# Altium schematic sheet BOC_Top.SchDoc: Board-On-Chip Block Diagram
size A; Organization: Altium Limited; Address1: L3, 12a Rodborough Rd; Address2: Frenchs Forest; Address3: NSW; Address4: Australia 2086; Revision: 1.06; SheetNumber: 1; SheetTotal: 16
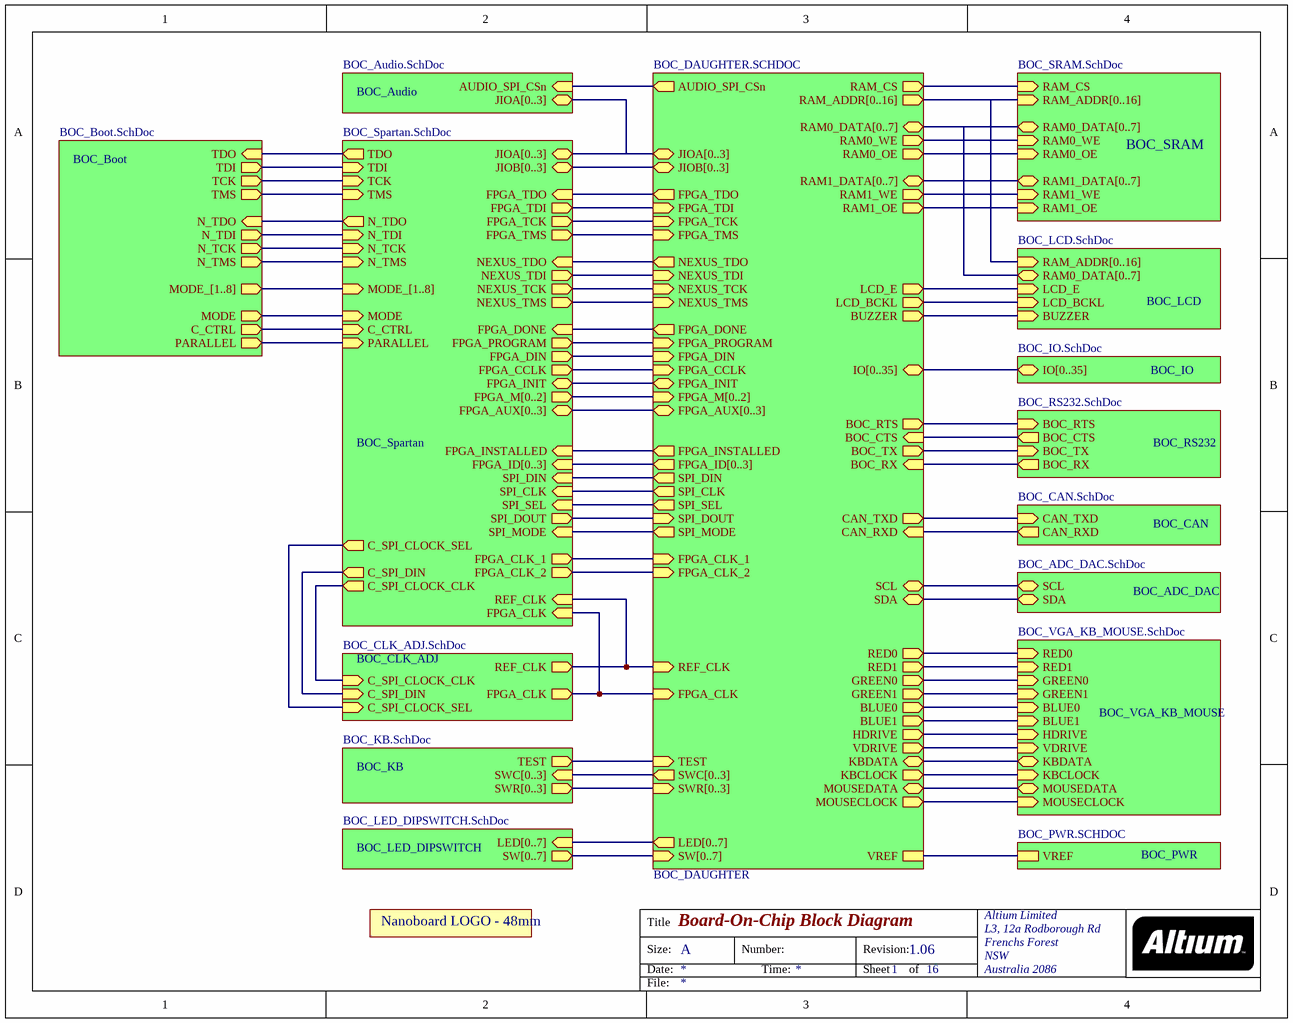
[diagram p0: BOC_Top.SchDoc]

## Parts
LOGO1  NanoboardLogo48mm  [NanoboardLogo48mm]  (value not drawn)  (graphical)

## Sub-sheets
BOC_ADC_DAC = BOC_ADC_DAC.SchDoc: SCL (bidir), SDA (bidir)
BOC_Audio = BOC_Audio.SchDoc: AUDIO_SPI_CSn (in), JIOA[0..3] (bidir)
BOC_Boot = BOC_Boot.SchDoc: TCK (out), TDO (in), TDI (out), TMS (out), C_CTRL (out), PARALLEL (out), MODE_[1..8] (out), N_TDI (out), N_TDO (in), N_TCK (out), N_TMS (out), MODE (out)
BOC_CAN = BOC_CAN.SchDoc: CAN_TXD (in), CAN_RXD (out)
BOC_CLK_ADJ = BOC_CLK_ADJ.SchDoc: FPGA_CLK (out), REF_CLK (out), C_SPI_CLOCK_SEL (in), C_SPI_DIN (in), C_SPI_CLOCK_CLK (in)
BOC_DAUGHTER = BOC_DAUGHTER.SCHDOC: FPGA_DONE (out), FPGA_PROGRAM (in), FPGA_CCLK (in), FPGA_DIN (in), IO[0..35] (bidir), BOC_RTS (out), BOC_TX (out), BOC_CTS (in), BOC_RX (in), CAN_TXD (out), CAN_RXD (in), JIOA[0..3] (bidir), JIOB[0..3] (bidir), LED[0..7] (out), SW[0..7] (in), LCD_BCKL (out), FPGA_AUX[0..3] (bidir), FPGA_M[0..2] (in), FPGA_TDI (in), FPGA_TCK (in), FPGA_TMS (in), FPGA_TDO (out), RAM_ADDR[0..16] (out), RAM0_DATA[0..7] (bidir), RAM1_DATA[0..7] (bidir), RAM0_OE (out), RAM0_WE (out), RAM1_OE (out), RAM1_WE (out), RAM_CS (out), RED0 (out), RED1 (out), GREEN0 (out), GREEN1 (out), BLUE0 (out), BLUE1 (out), HDRIVE (out), VDRIVE (out), KBDATA (bidir), KBCLOCK (out), MOUSEDATA (bidir), MOUSECLOCK (out), SWC[0..3] (out), SWR[0..3] (in), FPGA_CLK (in), TEST (in), SCL (bidir), SDA (bidir), NEXUS_TDI (in), NEXUS_TCK (in), NEXUS_TMS (in), NEXUS_TDO (out), BUZZER (out), FPGA_INIT (bidir), VREF, SPI_MODE (out), SPI_DOUT (in), SPI_SEL (out), SPI_CLK (out), SPI_DIN (out), FPGA_CLK_1 (in), FPGA_CLK_2 (in), FPGA_INSTALLED (out), REF_CLK (in), FPGA_ID[0..3] (out), LCD_E (out), AUDIO_SPI_CSn (out)
BOC_IO = BOC_IO.SchDoc: IO[0..35] (bidir)
BOC_KB = BOC_KB.SchDoc: SWC[0..3] (in), SWR[0..3] (out), TEST (out)
BOC_LCD = BOC_LCD.SchDoc: RAM0_DATA[0..7] (bidir), LCD_BCKL (in), RAM_ADDR[0..16] (in), BUZZER (in), LCD_E (in)
BOC_LED_DIPSWITCH = BOC_LED_DIPSWITCH.SchDoc: LED[0..7] (in), SW[0..7] (out)
BOC_PWR = BOC_PWR.SCHDOC: VREF
BOC_RS232 = BOC_RS232.SchDoc: BOC_RTS (in), BOC_TX (in), BOC_CTS (out), BOC_RX (out)
BOC_Spartan = BOC_Spartan.SchDoc: FPGA_TDI (out), FPGA_TCK (out), FPGA_TMS (out), FPGA_TDO (in), FPGA_DONE (in), FPGA_PROGRAM (out), FPGA_CCLK (out), FPGA_DIN (out), FPGA_AUX[0..3] (bidir), FPGA_M[0..2] (out), JIOA[0..3] (bidir), JIOB[0..3] (bidir), REF_CLK (in), FPGA_INIT (bidir), NEXUS_TDO (in), NEXUS_TDI (out), NEXUS_TCK (out), NEXUS_TMS (out), FPGA_CLK_1 (out), FPGA_CLK_2 (out), FPGA_INSTALLED (in), SPI_DIN (in), SPI_CLK (in), SPI_SEL (in), SPI_DOUT (out), SPI_MODE (in), C_SPI_CLOCK_CLK (out), C_SPI_DIN (out), C_SPI_CLOCK_SEL (out), FPGA_ID[0..3] (in), TCK (in), TDO (out), TDI (in), TMS (in), C_CTRL (in), PARALLEL (in), MODE_[1..8] (in), N_TDI (in), N_TDO (out), N_TCK (in), N_TMS (in), MODE (in), FPGA_CLK (in)
BOC_SRAM = BOC_SRAM.SchDoc: RAM_ADDR[0..16] (in), RAM1_DATA[0..7] (bidir), RAM0_WE (in), RAM0_OE (in), RAM1_WE (in), RAM1_OE (in), RAM_CS (in), RAM0_DATA[0..7] (bidir)
BOC_VGA_KB_MOUSE = BOC_VGA_KB_MOUSE.SchDoc: RED0 (in), RED1 (in), GREEN0 (in), GREEN1 (in), BLUE0 (in), BLUE1 (in), HDRIVE (in), VDRIVE (in), KBDATA (bidir), KBCLOCK (in), MOUSEDATA (bidir), MOUSECLOCK (in)

## Nets
(unnamed): sheet BOC_SRAM/RAM0_WE, sheet BOC_DAUGHTER/RAM0_WE
(unnamed): sheet BOC_SRAM/RAM0_OE, sheet BOC_DAUGHTER/RAM0_OE
(unnamed): sheet BOC_SRAM/RAM1_WE, sheet BOC_DAUGHTER/RAM1_WE
(unnamed): sheet BOC_SRAM/RAM1_OE, sheet BOC_DAUGHTER/RAM1_OE
(unnamed): sheet BOC_SRAM/RAM_CS, sheet BOC_DAUGHTER/RAM_CS
(unnamed): sheet BOC_KB/TEST, sheet BOC_DAUGHTER/TEST
(unnamed): sheet BOC_PWR/VREF, sheet BOC_DAUGHTER/VREF
(unnamed): sheet BOC_RS232/BOC_RTS, sheet BOC_DAUGHTER/BOC_RTS
(unnamed): sheet BOC_RS232/BOC_TX, sheet BOC_DAUGHTER/BOC_TX
(unnamed): sheet BOC_RS232/BOC_CTS, sheet BOC_DAUGHTER/BOC_CTS
(unnamed): sheet BOC_RS232/BOC_RX, sheet BOC_DAUGHTER/BOC_RX
(unnamed): sheet BOC_ADC_DAC/SCL, sheet BOC_DAUGHTER/SCL
(unnamed): sheet BOC_ADC_DAC/SDA, sheet BOC_DAUGHTER/SDA
(unnamed): sheet BOC_CAN/CAN_TXD, sheet BOC_DAUGHTER/CAN_TXD
(unnamed): sheet BOC_CAN/CAN_RXD, sheet BOC_DAUGHTER/CAN_RXD
(unnamed): sheet BOC_CLK_ADJ/FPGA_CLK, sheet BOC_Spartan/FPGA_CLK, sheet BOC_DAUGHTER/FPGA_CLK
(unnamed): sheet BOC_CLK_ADJ/REF_CLK, sheet BOC_Spartan/REF_CLK, sheet BOC_DAUGHTER/REF_CLK
(unnamed): sheet BOC_CLK_ADJ/C_SPI_CLOCK_SEL, sheet BOC_Spartan/C_SPI_CLOCK_SEL
(unnamed): sheet BOC_CLK_ADJ/C_SPI_DIN, sheet BOC_Spartan/C_SPI_DIN
(unnamed): sheet BOC_CLK_ADJ/C_SPI_CLOCK_CLK, sheet BOC_Spartan/C_SPI_CLOCK_CLK
(unnamed): sheet BOC_LCD/LCD_BCKL, sheet BOC_DAUGHTER/LCD_BCKL
(unnamed): sheet BOC_LCD/BUZZER, sheet BOC_DAUGHTER/BUZZER
(unnamed): sheet BOC_LCD/LCD_E, sheet BOC_DAUGHTER/LCD_E
(unnamed): sheet BOC_VGA_KB_MOUSE/RED0, sheet BOC_DAUGHTER/RED0
(unnamed): sheet BOC_VGA_KB_MOUSE/RED1, sheet BOC_DAUGHTER/RED1
(unnamed): sheet BOC_VGA_KB_MOUSE/GREEN0, sheet BOC_DAUGHTER/GREEN0
(unnamed): sheet BOC_VGA_KB_MOUSE/GREEN1, sheet BOC_DAUGHTER/GREEN1
(unnamed): sheet BOC_VGA_KB_MOUSE/BLUE0, sheet BOC_DAUGHTER/BLUE0
(unnamed): sheet BOC_VGA_KB_MOUSE/BLUE1, sheet BOC_DAUGHTER/BLUE1
(unnamed): sheet BOC_VGA_KB_MOUSE/HDRIVE, sheet BOC_DAUGHTER/HDRIVE
(unnamed): sheet BOC_VGA_KB_MOUSE/VDRIVE, sheet BOC_DAUGHTER/VDRIVE
(unnamed): sheet BOC_VGA_KB_MOUSE/KBDATA, sheet BOC_DAUGHTER/KBDATA
(unnamed): sheet BOC_VGA_KB_MOUSE/KBCLOCK, sheet BOC_DAUGHTER/KBCLOCK
(unnamed): sheet BOC_VGA_KB_MOUSE/MOUSEDATA, sheet BOC_DAUGHTER/MOUSEDATA
(unnamed): sheet BOC_VGA_KB_MOUSE/MOUSECLOCK, sheet BOC_DAUGHTER/MOUSECLOCK
(unnamed): sheet BOC_Spartan/FPGA_TDI, sheet BOC_DAUGHTER/FPGA_TDI
(unnamed): sheet BOC_Spartan/FPGA_TCK, sheet BOC_DAUGHTER/FPGA_TCK
(unnamed): sheet BOC_Spartan/FPGA_TMS, sheet BOC_DAUGHTER/FPGA_TMS
(unnamed): sheet BOC_Spartan/FPGA_TDO, sheet BOC_DAUGHTER/FPGA_TDO
(unnamed): sheet BOC_Spartan/FPGA_DONE, sheet BOC_DAUGHTER/FPGA_DONE
(unnamed): sheet BOC_Spartan/FPGA_PROGRAM, sheet BOC_DAUGHTER/FPGA_PROGRAM
(unnamed): sheet BOC_Spartan/FPGA_CCLK, sheet BOC_DAUGHTER/FPGA_CCLK
(unnamed): sheet BOC_Spartan/FPGA_DIN, sheet BOC_DAUGHTER/FPGA_DIN
(unnamed): sheet BOC_Spartan/FPGA_INIT, sheet BOC_DAUGHTER/FPGA_INIT
(unnamed): sheet BOC_Spartan/NEXUS_TDO, sheet BOC_DAUGHTER/NEXUS_TDO
(unnamed): sheet BOC_Spartan/NEXUS_TDI, sheet BOC_DAUGHTER/NEXUS_TDI
(unnamed): sheet BOC_Spartan/NEXUS_TCK, sheet BOC_DAUGHTER/NEXUS_TCK
(unnamed): sheet BOC_Spartan/NEXUS_TMS, sheet BOC_DAUGHTER/NEXUS_TMS
(unnamed): sheet BOC_Spartan/FPGA_CLK_1, sheet BOC_DAUGHTER/FPGA_CLK_1
(unnamed): sheet BOC_Spartan/FPGA_CLK_2, sheet BOC_DAUGHTER/FPGA_CLK_2
(unnamed): sheet BOC_Spartan/FPGA_INSTALLED, sheet BOC_DAUGHTER/FPGA_INSTALLED
(unnamed): sheet BOC_Spartan/SPI_DIN, sheet BOC_DAUGHTER/SPI_DIN
(unnamed): sheet BOC_Spartan/SPI_CLK, sheet BOC_DAUGHTER/SPI_CLK
(unnamed): sheet BOC_Spartan/SPI_SEL, sheet BOC_DAUGHTER/SPI_SEL
(unnamed): sheet BOC_Spartan/SPI_DOUT, sheet BOC_DAUGHTER/SPI_DOUT
(unnamed): sheet BOC_Spartan/SPI_MODE, sheet BOC_DAUGHTER/SPI_MODE
(unnamed): sheet BOC_Spartan/TCK, sheet BOC_Boot/TCK
(unnamed): sheet BOC_Spartan/TDO, sheet BOC_Boot/TDO
(unnamed): sheet BOC_Spartan/TDI, sheet BOC_Boot/TDI
(unnamed): sheet BOC_Spartan/TMS, sheet BOC_Boot/TMS
(unnamed): sheet BOC_Spartan/C_CTRL, sheet BOC_Boot/C_CTRL
(unnamed): sheet BOC_Spartan/PARALLEL, sheet BOC_Boot/PARALLEL
(unnamed): sheet BOC_Spartan/N_TDI, sheet BOC_Boot/N_TDI
(unnamed): sheet BOC_Spartan/N_TDO, sheet BOC_Boot/N_TDO
(unnamed): sheet BOC_Spartan/N_TCK, sheet BOC_Boot/N_TCK
(unnamed): sheet BOC_Spartan/N_TMS, sheet BOC_Boot/N_TMS
(unnamed): sheet BOC_Spartan/MODE, sheet BOC_Boot/MODE
(unnamed): sheet BOC_DAUGHTER/AUDIO_SPI_CSn, sheet BOC_Audio/AUDIO_SPI_CSn

## Buses and harness runs
bus sheet BOC_Audio/JIOA[0..3] = sheet BOC_DAUGHTER/JIOA[0..3] = sheet BOC_Spartan/JIOA[0..3]
bus sheet BOC_Boot/MODE_[1..8] = sheet BOC_Spartan/MODE_[1..8]
bus sheet BOC_DAUGHTER/FPGA_AUX[0..3] = sheet BOC_Spartan/FPGA_AUX[0..3]
bus sheet BOC_DAUGHTER/FPGA_ID[0..3] = sheet BOC_Spartan/FPGA_ID[0..3]
bus sheet BOC_DAUGHTER/FPGA_M[0..2] = sheet BOC_Spartan/FPGA_M[0..2]
bus sheet BOC_DAUGHTER/IO[0..35] = sheet BOC_IO/IO[0..35]
bus sheet BOC_DAUGHTER/JIOB[0..3] = sheet BOC_Spartan/JIOB[0..3]
bus sheet BOC_DAUGHTER/LED[0..7] = sheet BOC_LED_DIPSWITCH/LED[0..7]
bus sheet BOC_DAUGHTER/RAM0_DATA[0..7] = sheet BOC_LCD/RAM0_DATA[0..7] = sheet BOC_SRAM/RAM0_DATA[0..7]
bus sheet BOC_DAUGHTER/RAM1_DATA[0..7] = sheet BOC_SRAM/RAM1_DATA[0..7]
bus sheet BOC_DAUGHTER/RAM_ADDR[0..16] = sheet BOC_LCD/RAM_ADDR[0..16] = sheet BOC_SRAM/RAM_ADDR[0..16]
bus sheet BOC_DAUGHTER/SW[0..7] = sheet BOC_LED_DIPSWITCH/SW[0..7]
bus sheet BOC_DAUGHTER/SWC[0..3] = sheet BOC_KB/SWC[0..3]
bus sheet BOC_DAUGHTER/SWR[0..3] = sheet BOC_KB/SWR[0..3]

## Notes on the sheet
- Title
- Size:
- Date:
- A
- Number:
- Time:
- Revision:
- Sheet
- of
- File:
- (in symbol NanoboardLogo48mm) Nanoboard LOGO - 48mm